# Altium schematic sheet USERPWR.SchDoc: USER IO Power Loopback
size A4; Organization: Altium Limited.
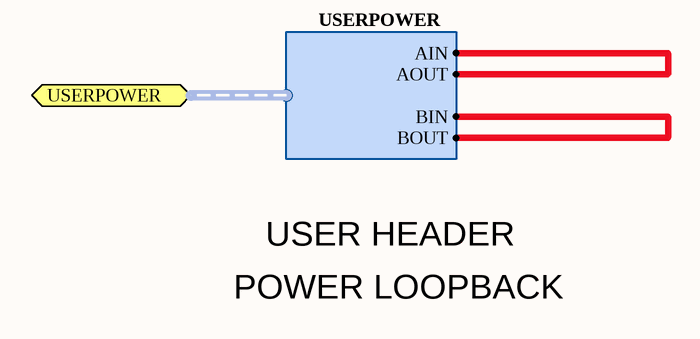
[diagram p0: USERPWR.SchDoc]

## Ports
USERPOWER (harness USERPOWER)

## Harnesses
USERPOWER: AIN, BIN, AOUT, BOUT

## Nets
(unnamed): port USERPOWER.AIN, port USERPOWER.AOUT
(unnamed): port USERPOWER.BIN, port USERPOWER.BOUT

## Notes on the sheet
- POWER LOOPBACK
- USER HEADER
- Sheet Title
- Project Title
- Size:
- Date:
- A4
- Assy:
- Time:
- Revision:
- Sheet
- of
- File: